# Altium schematic sheet Current Sensor.SchDoc: Hall Effect Current Sensor
size Letter; DrawnBy: Kyle Hong; SheetNumber: 1; SheetTotal: 1
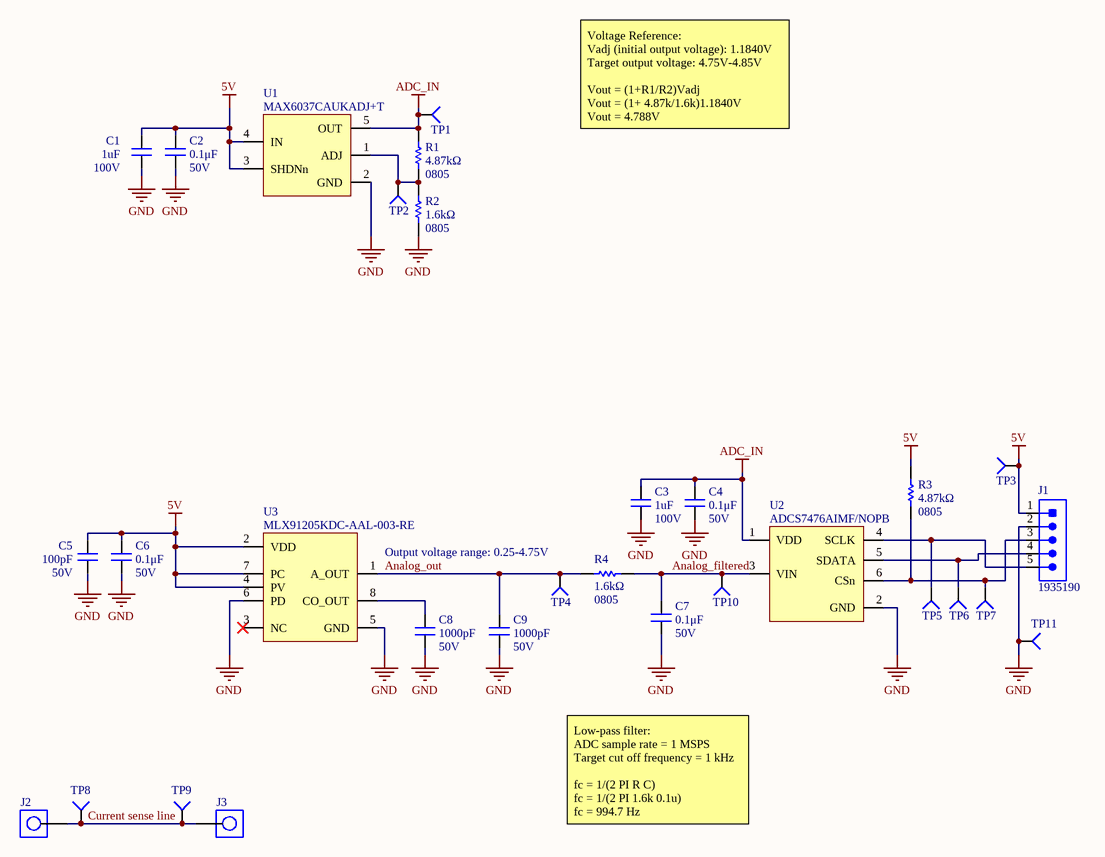
[diagram p0: Current Sensor.SchDoc]

## Parts
C1  Capacitance: 1uF  Voltage Rating: 100V  [CAPC3216X190X50NL20T25]  (hidden comment: CAP_1uF_100V_1206)
C2  0.1μF  Voltage Rating: 50V  [CAP2012]
C3  Capacitance: 1uF  Voltage Rating: 100V  [CAPC3216X190X50NL20T25]  (hidden comment: CAP_1uF_100V_1206)
C4  0.1μF  Voltage Rating: 50V  [CAP2012]
C5  value 100pF  Voltage Rating: 50V  [CAP2012]  (hidden comment: CAP_100pF_50V_0805)
C6  0.1μF  Voltage Rating: 50V  [CAP2012]
C7  0.1μF  Voltage Rating: 50V  [CAP2012]
C8  Voltage Rating: 50V  Capacitance: 1000pF  [CAP2012]  (hidden comment: CAP_1000pF_50V_0805)
C9  Voltage Rating: 50V  Capacitance: 1000pF  [CAP2012]  (hidden comment: CAP_1000pF_50V_0805)
J1  CON_5M_TERM  [1935190]  (value not drawn)
J2  Screw Terminal 6-32  [7701_KEYSTONE]  (value not drawn)
J3  Screw Terminal 6-32  [7701_KEYSTONE]  (value not drawn)
R1  Case Code (Imperial): 0805  Resistance: 4.87kΩ  [RESC0805(2012)_H]  (hidden comment: RES_4.87kΩ_0805)
R2  Case/Package: 0805  Resistance: 1.6kΩ  [RESC0805(2012)_H]  (hidden comment: RES_1.6kΩ_0805)
R3  Case Code (Imperial): 0805  Resistance: 4.87kΩ  [RESC0805(2012)_H]  (hidden comment: RES_4.87kΩ_0805)
R4  Case/Package: 0805  Resistance: 1.6kΩ  [RESC0805(2012)_H]  (hidden comment: RES_1.6kΩ_0805)
TP1  TESTPOINT_SMD_LOOP  [S1751-46R]  (value not drawn)
TP2  TESTPOINT_1MM_CIRCLE  [TESTPOINT_CIRCLE_1MM]  (value not drawn)
TP3  TESTPOINT_SMD_LOOP  [S1751-46R]  (value not drawn)
TP4  TESTPOINT_1MM_CIRCLE  [TESTPOINT_CIRCLE_1MM]  (value not drawn)
TP5  TESTPOINT_1MM_CIRCLE  [TESTPOINT_CIRCLE_1MM]  (value not drawn)
TP6  TESTPOINT_1MM_CIRCLE  [TESTPOINT_CIRCLE_1MM]  (value not drawn)
TP7  TESTPOINT_1MM_CIRCLE  [TESTPOINT_CIRCLE_1MM]  (value not drawn)
TP8  TESTPOINT_SMD_LOOP  [S1751-46R]  (value not drawn)
TP9  TESTPOINT_SMD_LOOP  [S1751-46R]  (value not drawn)
TP10  TESTPOINT_1MM_CIRCLE  [TESTPOINT_CIRCLE_1MM]  (value not drawn)
TP11  TESTPOINT_1MM_SQUARE  [TESTPOINT_SQUARE_1MM]  (value not drawn)
U1  MAX6037CAUKADJ+T  [SOT23-5]
U2  ADCS7476AIMF/NOPB  [ADCS747x]
U3  MLX91205KDC-AAL-003-RE  [8-SOIC_M]

## Nets
5V: C1.2 C2.2 C5.2 C6.2 J1.1 R3.2 TP3.1(=value) U1.3(SHDNn) U1.4(IN) U3.2(VDD) U3.4(PV) U3.7(PC)
ADC_IN: C3.2 C4.2 R1.2 TP1.1(=value) U1.5(OUT) U2.1(VDD)
GND: C1.1 C2.1 C3.1 C4.1 C5.1 C6.1 C7.1 C8.1 C9.1 J1.2 R2.1 TP11.1(=value) U1.2(GND) U2.2(GND) U3.5(GND) U3.6(PD)
Analog_filtered: C7.2 R4.1 TP10.1(=value) U2.3(VIN)
Analog_out: C9.2 R4.2 TP4.1(=value) U3.1(A_OUT)
Current sense line: J2.1 J3.1 TP8.1(=value) TP9.1(=value)
NetC8_2: C8.2 U3.8(CO_OUT)
NetJ1_3: J1.3 R3.1 TP7.1(=value) U2.6(CSn)
NetJ1_4: J1.4 TP6.1(=value) U2.5(SDATA)
NetJ1_5: J1.5 TP5.1(=value) U2.4(SCLK)
NetR1_1: R1.1 R2.2 TP2.1(=value) U1.1(ADJ)

Not connected (* = marked no-connect by the designer): U3 3(NC)*

## Notes on the sheet
- Voltage Reference:
  Vadj (initial output voltage): 1.1840V
  Target output voltage: 4.75V-4.85V
  Vout = (1+R1/R2)Vadj
  Vout = (1+ 4.87k/1.6k)1.1840V
  Vout = 4.788V
- Output voltage range: 0.25-4.75V
- Low-pass filter:
  ADC sample rate = 1 MSPS
  Target cut off frequency = 1 kHz
  fc = 1/(2 PI R C)
  fc = 1/(2 PI 1.6k 0.1u)
  fc = 994.7 Hz
- Title
- Size:
- Date:
- Letter
- Drawn By:
- Sheet
- of
- File:

## Library data of the parts
C1 C3 = CAP_1uF_100V_1206: CAP CER 1UF 100V X7R 1206; Manufacturer: Murata; Manufacturer Part Number: GCJ31CR72A105KA01L; Tolerance: 10%; Supplier 1: Digi-Key; RoHS: No; Category: Ceramic Capacitors; Stock 1: 36535; Pricing 1: 1=0.69000, 10=0.48900, 50=0.37000, 100=0.32230, 500=0.23874, 1000=0.20294 (USD); Mount: Surface Mount; Case/Package: 1206; Min Operating Temperature: -55°C; Max Operating Temperature: 125°C; Features: Soft Termination; Packaging: Tape and Reel; Ratings: AEC-Q200; ComponentLink1URL: https://psearch.en.murata.com:443/capacitor/product/GCJ31CR72A105KA01%23.pdf?src-supplier=IHS+Markit; ComponentLink1Description: https://psearch.en.murata.com:443/capacitor/product/GCJ31CR72A105KA01%23.pdf?src-supplier=IHS+Markit; ComponentLink2URL: http://search.murata.co.jp/Ceramy/image/img/A01X/G101/ENG/GCJ31CR72A105KA01-01.pdf?src-supplier=Digi-Key; ComponentLink2Description: http://search.murata.co.jp/Ceramy/image/img/A01X/G101/ENG/GCJ31CR72A105KA01-01.pdf?src-supplier=Digi-Key; Supplier Part Number 1: 490-16468-1-ND
C2 C4 C6 C7 = CAP_0.1uF_50V_0805: CAP CER 0.1UF 50V X7R 0805; Manufacturer 1: Murata Electronics; Manufacturer Part Number 1: GCD21BR71H104KA01L; Tolerance: 10%; Mount: Surface Mount; Case Code (Metric): 2012; Case Code (Imperial): 0805; Min Operating Temperature: -55°C; Max Operating Temperature: 125°C; Dielectric: X7R; Termination: SMD/SMT; Length: 2mm; Height: 1.25mm; Width: 0.049inch; Thickness: 0.049inch; Depth: 1.25mm; Ratings: AEC-Q200; Supplier 1: Digi-Key; Supplier Part Number 1: 490-11955-1-ND; Package: 0805 (2012 Metric); Value: 0.1μF
C5 = CAP_100pF_50V_0805: CAP CER 100PF 50V C0G/NP0 0805; Manufacturer 1: KEMET; Manufacturer Part Number 1: C0805C101J5GACTU; Tolerance: 5%; Dielectric: C0G, NP0; Mount: Surface Mount; Case Code (Metric): 2012; Case Code (Imperial): 0805; Min Operating Temperature: -55°C; Max Operating Temperature: 125°C; Termination: SMD/SMT; Supplier 1: Digi-Key; Supplier Part Number 1: 399-1122-1-ND; Package: 0805 (2012 Metric)
C8 C9 = CAP_1000pF_50V_0805: CAP CER 1000pF 50V X7R 0805; Manufacturer 1: Samsung; Manufacturer Part Number 1: CL21B102KBANNNC; Material: Ceramic; Tolerance: 10%; Supplier 1: Digi-Key; RoHS: Yes; Category: Ceramic Capacitors; Stock 1: 974042; Pricing 1: 1=0.10000, 10=0.04200, 50=0.02300, 100=0.01880, 500=0.01340, 1000=0.01053 (USD); Mount: Surface Mount; Case/Package: 0805; Case Code (Imperial): 0805; Contact Plating: Tin; Case Code (Metric): 2012; Min Operating Temperature: -55°C; Max Operating Temperature: 125°C; Dielectric: X7R; Packaging: Tape and Reel; Package Quantity: 4000; Voltage: 50V; Length: 2mm; Height: 0.65mm; Depth: 1.25mm; Thickness: 0.03inch; Width: 0.049inch; Radiation Hardening: No; ComponentLink1URL: https://datasheet.ciiva.com:443/pdfs/VipMasterIC/IC/SEMS/SEMS-S-A0008520814/SEMS-S-A0008520759-1.pdf?src-supplier=IHS+Markit; ComponentLink1Description: https://datasheet.ciiva.com:443/pdfs/VipMasterIC/IC/SEMS/SEMS-S-A0008520814/SEMS-S-A0008520759-1.pdf?src-supplier=IHS+Markit; ComponentLink2URL: https://datasheet.ciiva.com/25802/cl21b102kbannnc-25802496.pdf?src-supplier=Digi-Key; ComponentLink2Description: https://datasheet.ciiva.com/25802/cl21b102kbannnc-25802496.pdf?src-supplier=Digi-Key; ComponentLink3URL: https://datasheet.ciiva.com/26838/getdatasheetpartid-357425-26838638.pdf?src-supplier=Verical; ComponentLink3Description: https://datasheet.ciiva.com/26838/getdatasheetpartid-357425-26838638.pdf?src-supplier=Verical; ComponentLink4URL: https://datasheet.ciiva.com/29199/456076-da-01-en-vs-kondensator-0805-29199069.pdf?src-supplier=Conrad; ComponentLink4Description: https://datasheet.ciiva.com/29199/456076-da-01-en-vs-kondensator-0805-29199069.pdf?src-supplier=Conrad; Supplier Part Number 1: 1276-1020-1-ND
J1 = CON_5M_TERM: Barrier Strip Terminal Block, 17.5A, 1.5mm2, 1 Row(s), 1 Deck(s); Manufacturer 1: Phoenix Contact; Number of Contacts: 5; Number of Poles: 1; Voltage Rating: 250V; Max Current Rating: 16A; Current: 18A; Voltage: 300V; Voltage Rating (DC): 320V; Pitch: 5mm; Wire Gauge (Max): 26AWG; Wire Gauge (Min): 12AWG; Approvals: UL,VDE,CB; Supplier 1: Digi-Key; RoHS: Yes; Category: Terminal Blocks; Stock 1: 5445; Pricing 1: 1=1.01000, 10=0.97000, 50=0.94380, 100=0.88200, 250=0.81144, 500=0.74976 (USD); Mount: Through Hole; Number of Pins: 5; Weight: 0.179192oz; Contact Material: Copper,Tin; Color: Green; Insulation Material: Nylon; Housing Material: Polyamide; Housing Color: Green; Number of Rows: 1; Termination: Screw; Package Quantity: 100; Orientation: Straight; Packaging: Bulk; Max Supply Voltage: 250V; Current Rating: 17.5A; Number of Levels: 1; Number of Positions Per Level: 5; Number of Positions: 5; Number of Circuits: 5; Length: 9mm; Height: 11.3mm; Width: 25mm; Depth: 9mm; Wire/Cable Gauge: 26AWG; Stripping Length: 5mm; Radiation Hardening: No; REACH SVHC: Unknown; Flammability Rating: UL94 V-0; Lead Free: Lead Free; ComponentLink1URL: https://datasheet.ciiva.com:443/pdfs/VipMasterIC/IC/PCON/PCONS16609/PCONS13702-1.pdf?src-supplier=IHS+Markit; ComponentLink1Description: https://datasheet.ciiva.com:443/pdfs/VipMasterIC/IC/PCON/PCONS16609/PCONS13702-1.pdf?src-supplier=IHS+Markit; ComponentLink2URL: https://datasheet.ciiva.com/823/combicon20compact205-0mm20series-823776.pdf?src-supplier=Digi-Key; ComponentLink2Description: https://datasheet.ciiva.com/823/combicon20compact205-0mm20series-823776.pdf?src-supplier=Digi-Key; ComponentLink3URL: https://datasheet.ciiva.com/16047/1935190-16047253.pdf?src-supplier=Onlinecomponents.com; ComponentLink3Description: https://datasheet.ciiva.com/16047/1935190-16047253.pdf?src-supplier=Onlinecomponents.com; ComponentLink4URL: https://datasheet.ciiva.com/26840/getdatasheetpartid-745201-26840566.pdf?src-supplier=Verical; ComponentLink4Description: https://datasheet.ciiva.com/26840/getdatasheetpartid-745201-26840566.pdf?src-supplier=Verical; Supplier Part Number 1: 277-1580-ND; Manufacturer Part Number 1: 1935190
J2 J3 = SCREW_TERMINAL_1_POS_6_32: TERM W/ASSEMBLD SCREW VERT PCMNT; Manufacturer 1: Keystone Electronics; Manufacturer Part Number 1: 7701; Max Current Rating: 15A; Number of Ports: 1; Insulation: Non-Insulated; Gender: Male; Supplier 1: Digi-Key; Mount: Through Hole; Number of Pins: 4; Contact Plating: Tin,Nickel; Contact Material: Brass; Material: Brass,Tin; Number of Terminals: 4; Color: Silver; Terminal Material: Brass; Current Rating: 15A; Termination: Solder; Number of Contacts: 1; Orientation: Straight; Diameter: 0.31inch; Length: 7.87mm; Height: 0.44inch; Depth: 7.87mm; REACH SVHC: No SVHC; Supplier Part Number 1: 36-7701-ND
R1 R3 = RES_4.87kΩ_0805: RES SMD 4.87k OHM 0.1% 1/8W 0805; Manufacturer 1: Panasonic; Manufacturer Part Number 1: ERA6AEB4871V; Temperature Coefficient: 25ppm/°C; Power Rating: 125mW; Voltage Rating: 100V; Supplier 1: Digi-Key; RoHS: Yes; Category: Chip SMD Resistors; Stock 1: 10532; Pricing 1: 1=0.31000, 10=0.26200, 100=0.10230, 1000=0.04284, 2500=0.03927 (USD); Mount: Surface Mount; Case/Package: 0805; Number of Pins: 2; Contact Plating: Tin; Case Code (Metric): 2012; Min Operating Temperature: -55°C; Max Operating Temperature: 155°C; Tolerance: 0.1%; Resistor Type: Thin Film,Metal Film; Packaging: Tape and Reel; Package Quantity: 1; Number of Terminations: 2; Termination: Solder; Max Power Dissipation: 125mW; Voltage Rating (DC): 100V; Features: Automotive AEC-Q200; Length: 2mm; Height: 0.5mm; Width: 1.25mm; Depth: 1.25mm; Radiation Hardening: No; REACH SVHC: No SVHC; Lead Free: Lead Free; ComponentLink1URL: https://datasheet.ciiva.com:443/pdfs/VipMasterIC/IC/PANA/PANA-S-A0009459258/PANA-S-A0009459258-1.pdf?src-supplier=IHS+Markit; ComponentLink1Description: https://datasheet.ciiva.com:443/pdfs/VipMasterIC/IC/PANA/PANA-S-A0009459258/PANA-S-A0009459258-1.pdf?src-supplier=IHS+Markit; ComponentLink2URL: https://datasheet.ciiva.com/11810/0900766b80eb1d8c-11810265.pdf?src-supplier=RSComponents; ComponentLink2Description: https://datasheet.ciiva.com/11810/0900766b80eb1d8c-11810265.pdf?src-supplier=RSComponents; ComponentLink3URL: https://datasheet.ciiva.com/26335/459399-da-01-en-widerstand-0805-era-26335821.pdf?src-supplier=Conrad; ComponentLink3Description: https://datasheet.ciiva.com/26335/459399-da-01-en-widerstand-0805-era-26335821.pdf?src-supplier=Conrad; ComponentLink4URL: https://datasheet.ciiva.com/5972/485442-5972630.pdf?src-supplier=Farnell; ComponentLink4Description: https://datasheet.ciiva.com/5972/485442-5972630.pdf?src-supplier=Farnell; ComponentLink5URL: https://datasheet.ciiva.com/17213/aoa0000ce26-17213081.pdf?src-supplier=Avnet+Europe; ComponentLink5Description: https://datasheet.ciiva.com/17213/aoa0000ce26-17213081.pdf?src-supplier=Avnet+Europe; ComponentLink6URL: https://datasheet.ciiva.com/9195/aoa0000ce26-9195612.pdf?src-supplier=Avnet; ComponentLink6Description: https://datasheet.ciiva.com/9195/aoa0000ce26-9195612.pdf?src-supplier=Avnet; ComponentLink7URL: https://datasheet.ciiva.com/5972/485442-5972623.pdf?src-supplier=Farnell; ComponentLink7Description: https://datasheet.ciiva.com/5972/485442-5972623.pdf?src-supplier=Farnell; Supplier Part Number 1: P4.87KDACT-ND
R2 R4 = RES_1.6kΩ_0805: RES SMD 1.6K OHM 0.1% 1/4W 0805; Manufacturer 1: Panasonic; Manufacturer Part Number 1: ERJ-PB6B1601V; Max Power Dissipation: 250mW; Temperature Coefficient: 50ppm/°C; Supplier 1: Digi-Key; RoHS: Yes; Category: Chip SMD Resistors; Stock 1: 10332; Pricing 1: 1=0.33000, 10=0.27800, 25=0.20240, 50=0.14680, 100=0.10880, 250=0.08348, 500=0.06578, 1000=0.04554 (USD); Case Code (Imperial): 0805; Case Code (Metric): 2012; Min Operating Temperature: -55°C; Max Operating Temperature: 155°C; Tolerance: 0.1%; Packaging: Tape and Reel; Resistor Type: Thick Film; Number of Terminations: 2; Features: Automotive AEC-Q200; Length: 0.079inch; Width: 0.049inch; Height - Seated (Max): 0.028inch; ComponentLink1URL: https://industrial.panasonic.com/sa/system/files/data/download/catalog/id_fixed-resistors_e_2.pdf?src-supplier=Digi-Key; ComponentLink1Description: https://industrial.panasonic.com/sa/system/files/data/download/catalog/id_fixed-resistors_e_2.pdf?src-supplier=Digi-Key; Supplier Part Number 1: P20615CT-ND
TP1 TP3 TP8 TP9 = TESTPOINT_SMD_LOOP: PC TEST POINT SMD; Manufacturer 1: Harwin; Plating: Tin; Number of Ports: 1; Supplier 1: Digi-Key; Manufacturer Part Number 1: S1751-46R; RoHS: Yes; Category: Terminal Blocks; Stock 1: 159143; Pricing 1: 1=0.29000, 10=0.27700, 25=0.23760, 50=0.20200, 100=0.19400, 250=0.17424, 500=0.16632, 1000=0.13860 (USD); Mount: Surface Mount; Material: Brass,Copper Alloy; Contact Material: Copper,Copper Alloy; Contact Plating: Tin; Color: Natural; Termination: Solder; Orientation: Straight; Number of Contacts: 1; Package Quantity: 2500; Packaging: Tape and Reel; Length: 3.25mm; Height: 2mm; Depth: 2mm; Width: 1.65mm; Radiation Hardening: No; REACH SVHC: No SVHC; ComponentLink1URL: https://datasheet.ciiva.com:443/pdfs/VipMasterIC/IC/HRWN/HRWN-S-A0002541722/HRWN-S-A0004513972-1.pdf?src-supplier=IHS+Markit; ComponentLink1Description: https://datasheet.ciiva.com:443/pdfs/VipMasterIC/IC/HRWN/HRWN-S-A0002541722/HRWN-S-A0004513972-1.pdf?src-supplier=IHS+Markit; ComponentLink2URL: https://datasheet.ciiva.com/5224/2010page161-58228-5224784.pdf?src-supplier=Mouser; ComponentLink2Description: https://datasheet.ciiva.com/5224/2010page161-58228-5224784.pdf?src-supplier=Mouser; ComponentLink3URL: https://datasheet.ciiva.com/22631/1688119-22631153.pdf?src-supplier=Element14; ComponentLink3Description: https://datasheet.ciiva.com/22631/1688119-22631153.pdf?src-supplier=Element14; ComponentLink4URL: https://datasheet.ciiva.com/2917/s1751-2917604.pdf?src-supplier=Digi-Key; ComponentLink4Description: https://datasheet.ciiva.com/2917/s1751-2917604.pdf?src-supplier=Digi-Key; ComponentLink5URL: https://datasheet.ciiva.com/1462/1693781-1462652.pdf?src-supplier=Farnell; ComponentLink5Description: https://datasheet.ciiva.com/1462/1693781-1462652.pdf?src-supplier=Farnell; ComponentLink6URL: https://datasheet.ciiva.com/1454/1693781-1454941.pdf?src-supplier=Element14; ComponentLink6Description: https://datasheet.ciiva.com/1454/1693781-1454941.pdf?src-supplier=Element14; Supplier Part Number 1: 952-1478-1-ND
TP2 TP4-TP7 TP10 = TESTPOINT_1MM_CIRCLE: TESTPOINT 1MM CIRCLE; Part Number (MPN): *
TP11 = TESTPOINT_1MM_SQUARE: TESTPOINT 1MM SQUARE; Part Number (MPN): *
U1 = MAX6037CAUKADJ+T: Three Terminal Voltage Reference, 1 Output, Trim/Adjustable, BICMOS, PDSO5; Manufacturer 1: Maxim; Output Voltage: 5V; Max Input Voltage: 6V; Max Output Current: 5mA; Reference Type: Series,Adjustable; Min Output Voltage: 1.184V; Operating Supply Current: 250uA; Tolerance: 0.5%; Number of Channels: 1; Temperature Coefficient: 50ppm/°C; Supplier 1: Digi-Key; RoHS: Yes; Category: Voltage References; Stock 1: 1921; Pricing 1: 1=2.52000, 10=2.26600, 25=2.14200, 100=1.76120, 250=1.58032, 500=1.54700 (USD); Mount: Surface Mount; Case/Package: SOT-23-5; Number of Pins: 5; Min Operating Temperature: -40°C; Max Operating Temperature: 125°C; Output Type: Adjustable; Max Output Voltage: 5V; Package Quantity: 2500; Packaging: Tape and Reel; Quiescent Current: 250uA; Output Current: 5mA; Reference Voltage: 5V; Radiation Hardening: No; Lead Free: Lead Free; REACH SVHC: Unknown; ComponentLink1URL: https://datasheet.ciiva.com:443/pdfs/VipMasterIC/IC/MAXM/MAXMS08662/MAXMS08662-1.pdf?src-supplier=IHS+Markit; ComponentLink1Description: https://datasheet.ciiva.com:443/pdfs/VipMasterIC/IC/MAXM/MAXMS08662/MAXMS08662-1.pdf?src-supplier=IHS+Markit; ComponentLink2URL: https://datasheet.ciiva.com/2008/max6037-max6037c-2008594.pdf?src-supplier=Digi-Key; ComponentLink2Description: https://datasheet.ciiva.com/2008/max6037-max6037c-2008594.pdf?src-supplier=Digi-Key; ComponentLink3URL: https://datasheet.ciiva.com/2008/max6037-max6037c-2008595.pdf?src-supplier=Digi-Key; ComponentLink3Description: https://datasheet.ciiva.com/2008/max6037-max6037c-2008595.pdf?src-supplier=Digi-Key; ComponentLink4URL: https://datasheet.ciiva.com/2008/max6037-max6037c-2008596.pdf?src-supplier=Digi-Key; ComponentLink4Description: https://datasheet.ciiva.com/2008/max6037-max6037c-2008596.pdf?src-supplier=Digi-Key; Supplier Part Number 1: MAX6037CAUKADJ+TCT-ND; Manufacturer Part Number 1: MAX6037CAUKADJ+T
U2 = ADCS7476AIMF/NOPB: 1-Channel Single ADC SAR 1Msps 12-bit Serial 6-Pin SOT-23 T/R; Manufacturer 1: TI National Semiconductor; Sampling Rate: 1MS/s; Resolution: 12b; Polarity: Unipolar; Number of Analog Inputs: 1; Nominal Supply Current: 2mA; Interface: SPI,Serial; Max Supply Voltage: 5.25V; Min Supply Voltage: 2.7V; Operating Supply Voltage: 5V; Number of Bits: 12; Integral Nonlinearity (INL): -1.1LSB; Signal to Noise Ratio (SNR): 72.5dB; Power Consumption: 2mW; Conversion Rate: 1000KS/s; Supplier 1: Digi-Key; RoHS: Yes; Category: Analog to Digital Converters (ADCs); Stock 1: 18495; Pricing 1: 1=3.31000, 10=2.97500, 25=2.81240, 100=2.31250, 250=2.07500, 500=2.00000 (USD); Mount: Surface Mount; Case/Package: SOT-23; Number of Pins: 6; Min Operating Temperature: -40°C; Max Operating Temperature: 125°C; Packaging: Tape and Reel; Number of Channels: 1; Number of Inputs: 1; Number of A/D Converters: 1; Number of Elements: 1; Package Quantity: 1000; Number of Converters: 1; Length: 2.92mm; Height: 1.02mm; Width: 1.6mm; Radiation Hardening: No; REACH SVHC: No SVHC; Lead Free: Lead Free; Supplier Part Number 1: ADCS7476AIMF/NOPBCT-ND; Manufacturer Part Number 1: ADCS7476AIMF/NOPB
U3 = MLX91205KDC-AAL-003-RE: Analog Circuit, 1 Func, PDSO8; Manufacturer 1: Melexis; Linearity: 0.5%; Accuracy: 2%; Operating Supply Current: 11mA; Response Time: 8us; Max Supply Current: 16mA; Polarity: Bidirectional; Number of Channels: 1; Frequency: 100kHz; Output Current: 1mA; Operating Supply Voltage: 5.5V; Supplier 1: Digi-Key; RoHS: Yes; Category: Current Sensors; Stock 1: 10592; Pricing 1: 1=2.27000, 25=2.17720, 100=2.12400 (USD); Mount: Surface Mount; Case/Package: SOIC; Number of Pins: 8; Min Operating Temperature: -40°C; Max Operating Temperature: 150°C; Package Quantity: 1; Packaging: Tape and Reel; Nominal Supply Current: 11mA; Lead Free: Lead Free; ComponentLink1URL: https://datasheet.ciiva.com:443/pdfs/VipMasterIC/IC/MELE/MELES00639/MELES00639-1.pdf?src-supplier=IHS+Markit; ComponentLink1Description: https://datasheet.ciiva.com:443/pdfs/VipMasterIC/IC/MELE/MELES00639/MELES00639-1.pdf?src-supplier=IHS+Markit; ComponentLink2URL: https://datasheet.ciiva.com/18494/mlx91205-datasheet-18494742.pdf?src-supplier=Digi-Key; ComponentLink2Description: https://datasheet.ciiva.com/18494/mlx91205-datasheet-18494742.pdf?src-supplier=Digi-Key; ComponentLink3URL: https://datasheet.ciiva.com/18494/mlx91205-datasheet-18494744.pdf?src-supplier=Digi-Key; ComponentLink3Description: https://datasheet.ciiva.com/18494/mlx91205-datasheet-18494744.pdf?src-supplier=Digi-Key; ComponentLink4URL: https://datasheet.ciiva.com/16462/mlx91205-datasheet-16462839.pdf?src-supplier=Future+Electronics; ComponentLink4Description: https://datasheet.ciiva.com/16462/mlx91205-datasheet-16462839.pdf?src-supplier=Future+Electronics; ComponentLink5URL: https://datasheet.ciiva.com/18494/mlx91205-datasheet-18494743.pdf?src-supplier=Digi-Key; ComponentLink5Description: https://datasheet.ciiva.com/18494/mlx91205-datasheet-18494743.pdf?src-supplier=Digi-Key; Supplier Part Number 1: MLX91205KDC-AAL-003-RECT-ND; Manufacturer Part Number 1: MLX91205KDC-AAL-003-RE